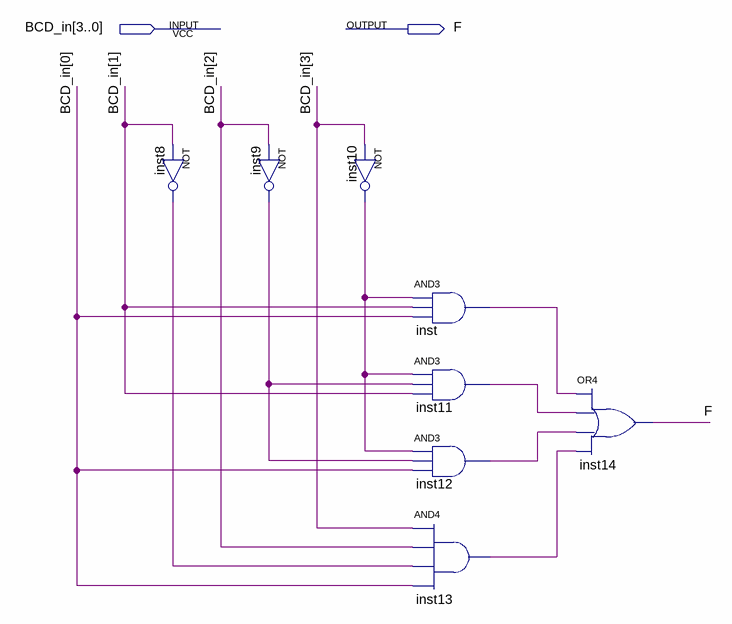
[diagram p0: schematic sheet]
// Quartus schematic BCD_F.bdf as structural Verilog: 8 symbols, 2 pins
module BCD_F (
  input  [3:0] BCD_in,
  output F
);

  wire inst8_out, inst9_out, inst10_out, inst11_out, inst12_out, inst13_out, inst_out;

  not inst8 (inst8_out, BCD_in[1]);
  not inst9 (inst9_out, BCD_in[2]);
  not inst10 (inst10_out, BCD_in[3]);
  and inst (inst_out, inst10_out, BCD_in[1], BCD_in[0]);
  and inst11 (inst11_out, inst10_out, inst9_out, BCD_in[1]);
  and inst12 (inst12_out, inst10_out, inst9_out, BCD_in[0]);
  and inst13 (inst13_out, BCD_in[3], BCD_in[2], inst8_out, BCD_in[0]);
  or inst14 (F, inst_out, inst11_out, inst12_out, inst13_out);
endmodule
